# Altium project FlashCraft.PrjPcb
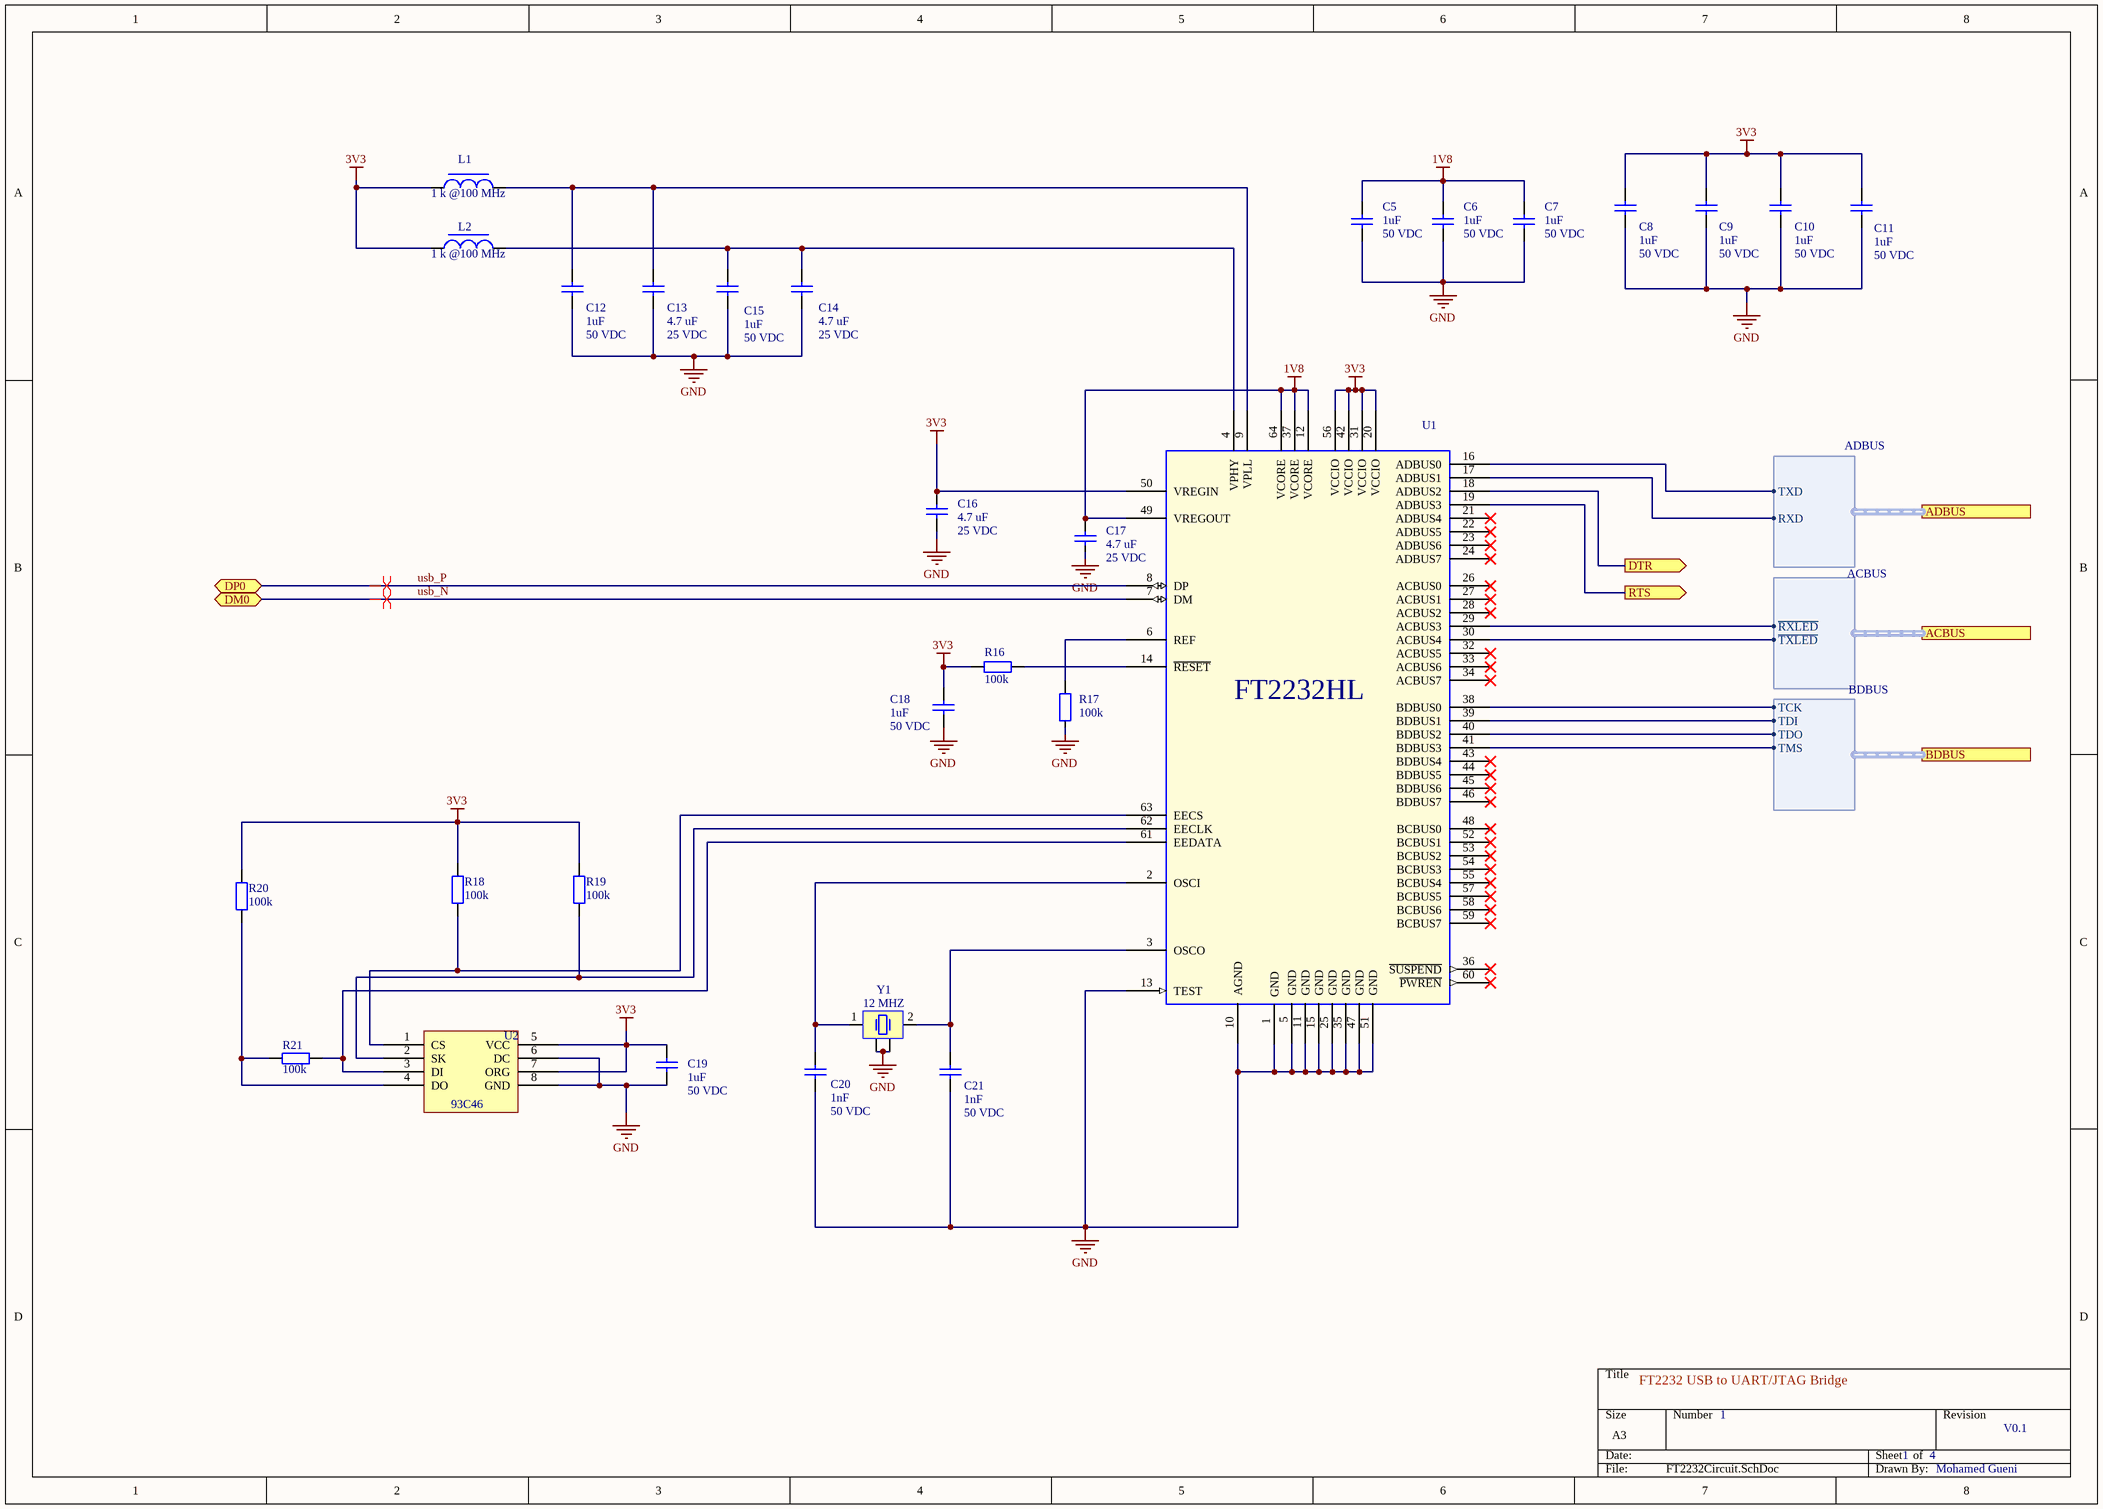
[diagram p0: FT2232Circuit.SchDoc]
4 sheets, 69 parts. Net scope: flat (ports and power ports of the same name join across sheets).
Board file: FlashCraft.PcbDoc
Sheets:
  FT2232Circuit.SchDoc
  USBandPOWER.SchDoc
  AutoProgramCircuit.SchDoc
  ConnectorsCircuit.SchDoc

## Sheet FT2232Circuit.SchDoc
size A3

### Parts
C5  Value 1: 1uF  Value 2: 50 VDC  [CAP-0603]  (hidden comment: Capacitor)
C6  Value 1: 1uF  Value 2: 50 VDC  [CAP-0603]  (hidden comment: Capacitor)
C7  Value 1: 1uF  Value 2: 50 VDC  [CAP-0603]  (hidden comment: Capacitor)
C8  Value 1: 1uF  Value 2: 50 VDC  [CAP-0603]  (hidden comment: Capacitor)
C9  Value 1: 1uF  Value 2: 50 VDC  [CAP-0603]  (hidden comment: Capacitor)
C10  Value 1: 1uF  Value 2: 50 VDC  [CAP-0603]  (hidden comment: Capacitor)
C11  Value 1: 1uF  Value 2: 50 VDC  [CAP-0603]  (hidden comment: Capacitor)
C12  Value 1: 1uF  Value 2: 50 VDC  [CAP-0603]  (hidden comment: Capacitor)
C13  Value 1: 4.7 uF  Value 2: 25 VDC  [CAP-0603]  (hidden comment: Capacitor)
C14  Value 1: 4.7 uF  Value 2: 25 VDC  [CAP-0603]  (hidden comment: Capacitor)
C15  Value 1: 1uF  Value 2: 50 VDC  [CAP-0603]  (hidden comment: Capacitor)
C16  Value 1: 4.7 uF  Value 2: 25 VDC  [CAP-0603]  (hidden comment: Capacitor)
C17  Value 1: 4.7 uF  Value 2: 25 VDC  [CAP-0603]  (hidden comment: Capacitor)
C18  Value 1: 1uF  Value 2: 50 VDC  [CAP-0603]  (hidden comment: Capacitor)
C19  Value 1: 1uF  Value 2: 50 VDC  [CAP-0603]  (hidden comment: Capacitor)
C20  Value 1: 1nF  Value 2: 50 VDC  [CAP-0603]  (hidden comment: Capacitor)
C21  Value 1: 1nF  Value 2: 50 VDC  [CAP-0603]  (hidden comment: Capacitor)
L1  Value 1: 1 k @100 MHz  [RESC3216X18N]  (hidden comment: MPZ1608S102A)
L2  Value 1: 1 k @100 MHz  [RESC3216X18N]  (hidden comment: MPZ1608S102A)
R16  Value 1: 100k  [R0603]  (hidden comment: Resistor)
R17  Value 1: 100k  [R0603]  (hidden comment: Resistor)
R18  Value 1: 100k  [R0603]  (hidden comment: Resistor)
R19  Value 1: 100k  [R0603]  (hidden comment: Resistor)
R20  Value 1: 100k  [R0603]  (hidden comment: Resistor)
R21  Value 1: 100k  [R0603]  (hidden comment: Resistor)
U1  FT2232HL-REEL  [TSQFP50P1200X1200X160-64N]  (value not drawn)
U2  93C46  [SOIC127P600X175-8N]  (value not drawn)
Y1  Value 1: 12 MHZ  [WE-4XTAL3.2x2.5mm]  (hidden comment: XTAL4)

### Ports
ACBUS (harness ACBUS), ADBUS (harness ADBUS), BDBUS (harness BDBUS), DM0 (bidir), DP0 (bidir), DTR (out), RTS (out)

### Harnesses
ADBUS: TXD, RXD
ACBUS: ~{RXLED}, ~{TXLED}
BDBUS: TCK, TDI, TDO, TMS

### Nets
1V8: C5.2 C6.2 C7.2 C17.2 U1.12(VCORE) U1.37(VCORE) U1.49(VREGOUT) U1.64(VCORE)
3V3: C8.2 C9.2 C10.2 C11.2 C16.2 C18.2 C19.2 L1.2 L2.2 R16.1 R18.2 R19.2 R20.2 U1.20(VCCIO) U1.31(VCCIO) U1.42(VCCIO) U1.50(VREGIN) U1.56(VCCIO) U2.5(VCC) U2.7(ORG)
GND: C5.1 C6.1 C7.1 C8.1 C9.1 C10.1 C11.1 C12.1 C13.1 C14.1 C15.1 C16.1 C17.1 C18.1 C19.1 C20.1 C21.1 R17.1 U1.1(GND) U1.5(GND) U1.10(AGND) U1.11(GND) U1.13(TEST) U1.15(GND) U1.25(GND) U1.35(GND) U1.47(GND) U1.51(GND) U2.6(DC) U2.8(GND) Y1.GND1 Y1.GND2
ESP-RXD: U1.17(ADBUS1) ; port ADBUS.RXD
ESP-TCK: U1.38(BDBUS0) ; port BDBUS.TCK
ESP-TDI: U1.39(BDBUS1) ; port BDBUS.TDI
ESP-TDO: U1.40(BDBUS2) ; port BDBUS.TDO
ESP-TMS: U1.41(BDBUS3) ; port BDBUS.TMS
ESP-TXD: U1.16(ADBUS0) ; port ADBUS.TXD
usb_N: U1.7(DM) ; port DM0
usb_P: U1.8(DP) ; port DP0
NetC12_2: C12.2 C13.2 L1.1 U1.9(VPLL)
NetC14_2: C14.2 C15.2 L2.1 U1.4(VPHY)
NetC20_2: C20.2 U1.2(OSCI) Y1.1(OSC1)
NetC21_2: C21.2 U1.3(OSCO) Y1.2(OSC2)
NetD1_3: U1.29(ACBUS3) ; port ACBUS.~{RXLED}
NetD1_4: U1.30(ACBUS4) ; port ACBUS.~{TXLED}
NetQ1_2: U1.19(ADBUS3) ; port RTS
NetQ2_2: U1.18(ADBUS2) ; port DTR
NetR16_2: R16.2 U1.14(~{RESET})
NetR17_2: R17.2 U1.6(REF)
NetR18_1: R18.1 U1.63(EECS) U2.1(CS)
NetR19_1: R19.1 U1.62(EECLK) U2.2(SK)
NetR20_1: R20.1 R21.2 U2.4(DO)
NetR21_1: R21.1 U1.61(EEDATA) U2.3(DI)

Not connected (* = marked no-connect by the designer): U1 21(ADBUS4)* 22(ADBUS5)* 23(ADBUS6)* 24(ADBUS7)* 26(ACBUS0)* 27(ACBUS1)* 28(ACBUS2)* 32(ACBUS5)* 33(ACBUS6)* 34(ACBUS7)* 36(~{SUSPEND})* 43(BDBUS4)* 44(BDBUS5)* 45(BDBUS6)* 46(BDBUS7)* 48(BCBUS0)* 52(BCBUS1)* 53(BCBUS2)* 54(BCBUS3)* 55(BCBUS4)* 57(BCBUS5)* 58(BCBUS6)* 59(BCBUS7)* 60(~{PWREN})*

### Layout directives
differential pair: usb_N, usb_P

### Notes on the sheet
- FT2232 USB to UART/JTAG Bridge
- 1
- 4
- V0.1
- Mohamed Gueni
- (in symbol U-000000002) FT2232HL

### Library data of the parts
C5-C12 C15 C18 C19 = C-000000011: DES: Multilayer Ceramic Capacitors MLCC - SMD/SMT Automotive Grade,MLCC,0603,X7R,50V,1uF,+/-10%,0.8mm; MAN: TDK; MANREF: CGA3E3X7R1H105K080AB; SUP: Mouser; SUPREF: 810-CGA3E3X7R1H105K0; TOL: 10%; FTP: 0603; NOTE: _; Part Number: C-000000011
C13 C14 = C-000000007: MAN: Multilayer Ceramic Capacitors MLCC - SMD/SMT 0603 25Vdc 4.7uF X6S 10%; MANREF: Murata Electronics; DES: GRT188C81E475KE13D; TOL: 10%; FTP: 0603; SUP: Mouser; SUPREF: 81-GRT188C81E475KE3D; NOTE: _; Part Number: C-000000007
C16 C17 = C-000000007: DES: GRT188C81E475KE13D; MAN: Multilayer Ceramic Capacitors MLCC - SMD/SMT 0603 25Vdc 4.7uF X6S 10%; MANREF: Murata Electronics; SUP: Mouser; SUPREF: 81-GRT188C81E475KE3D; TOL: 10%; FTP: 0603; NOTE: _; Part Number: C-000000007
C20 C21 = C-000000010: DES: C0603C102K5RECTU; MAN: Multilayer Ceramic Capacitors MLCC - SMD/SMT 50V 1000pF 0603 X7R 0.1; MANREF: KEMET; SUP: Mouser; SUPREF: 80-C0603C102K5REC; TOL: 10%; FTP: 0603; NOTE: _; Part Number: C-000000010
L1 L2 = L-000000001: DES: Ferrite Beads 1000ohms 0.3ohms 0.8A; MAN: TDK; SUP: Mouser; SUPREF: 810-MPZ1608S102A; Value 2: 800 mA; N°: L-000000001; MANREF: MPZ1608S102A; Footprint: 0603 (1608 metric); DataSheet: https://eu.mouser.com/datasheet/2/400/eads_commercial_power_mpz1608_en-923650.pdf
R16-R21 = R-000000002: TOL: 1 %; DES: Thick Film Resistors - SMD 1/10watt 100Kohms 1%; MAN: Vishay; MANREF: CRCW0603100KFKEA; SUP: Mouser; SUPREF: 71-CRCW0603-100K-E3; Value 2: 100 mW; Part Number: R-000000002; FTP: R0603; NOTE: -
U1 = U-000000002: MAN: USB Interface IC USB HS to Dual UART/ FIFO/SPI/JTAG/I2C; MANREF: FTDI; Value 1: Mouser; Value 2: LQFP-64; TOL: 895-FT2232HL; DES: FT2232HL-REEL; Part Number: U-000000002; NOTE: https://eu.mouser.com/datasheet/2/163/DS_FT2232H-17353.pdf
U2 = U-000000003: DES: 93C46B-I/SN; MAN: EEPROM 64x16; MANREF: Microchip Technology; Value 1: Mouser; Value 2: SOIC-8; TOL: 579-93C46B-I/SN; Part Number: U-000000003; NOTE: https://eu.mouser.com/datasheet/2/268/20001749K-277859.pdf
Y1 = Y-000000002: TOL: 10 PPM; DES: Crystals WE-XTAL 12.0MHz 10ppm 3.2 x 2.5mm; MAN: Wurth Elektronik; MANREF: 830105420809; SUP: Mouser; SUPREF: 710-830105420809; Value 2: 10 Pf; N°: Y-000000002; Footprint: 3.2 mm x 2.5 mm; DataSheet: https://www.we-online.com/components/products/datasheet/830105420809.pdf

## Sheet USBandPOWER.SchDoc
size A4
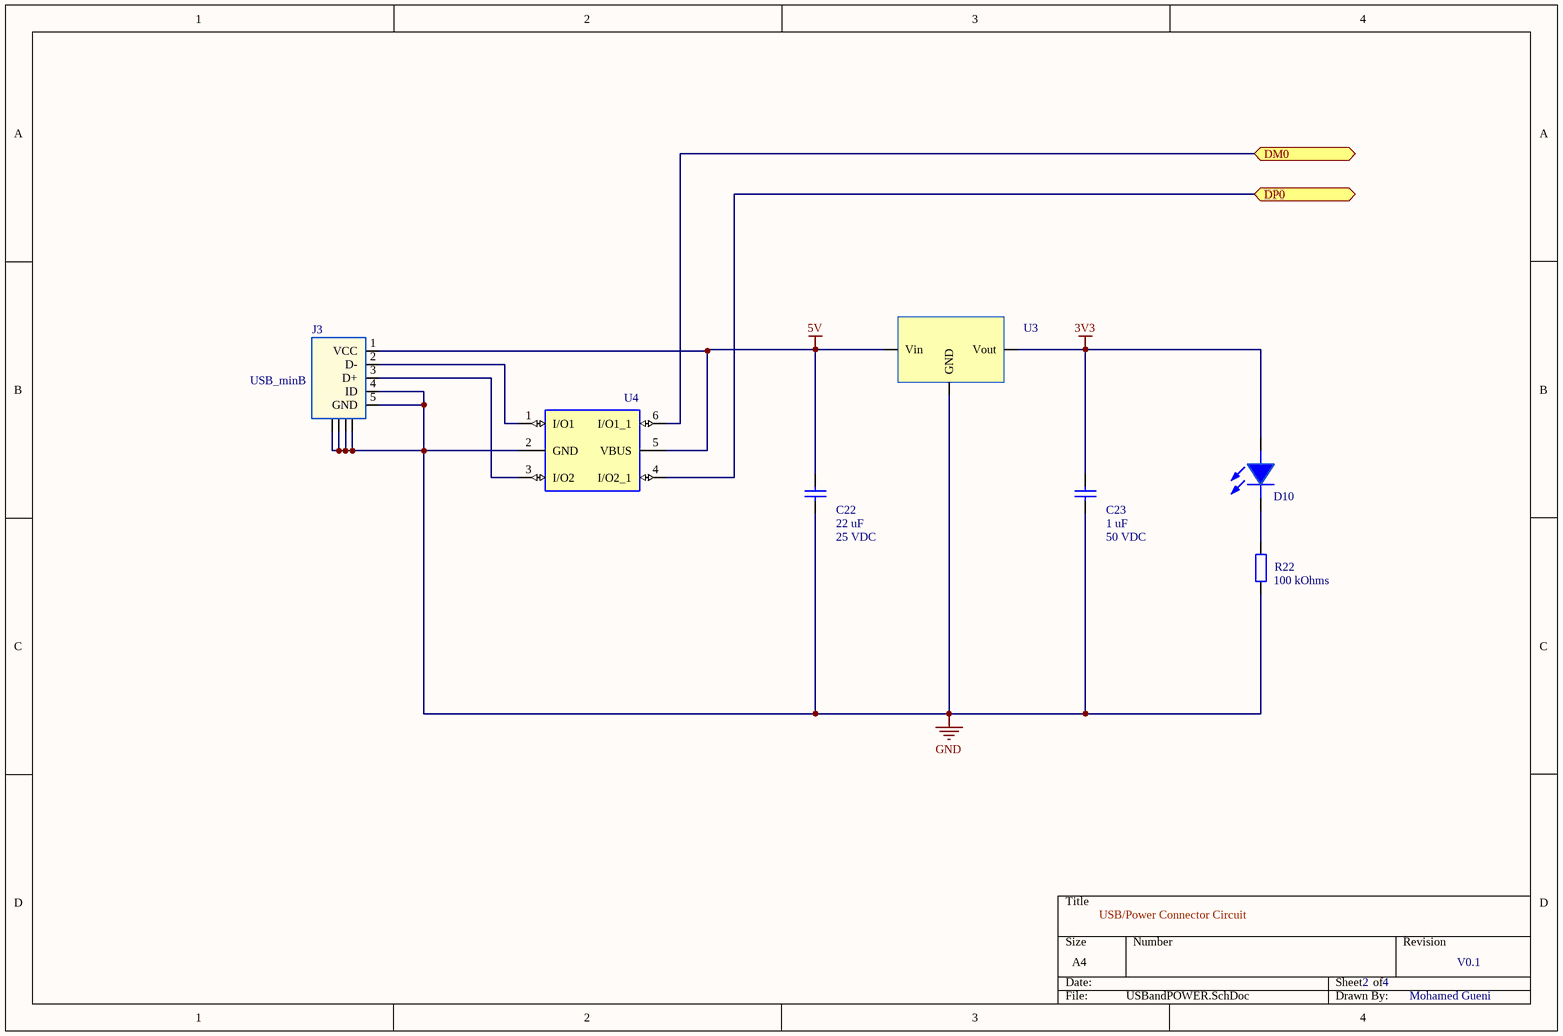
[diagram p1: USBandPOWER.SchDoc]

### Parts
C22  Value 1: 22 uF  Value 2: 25 VDC  [CAP-1210]  (hidden comment: Capacitor)
C23  Value 1: 1 uF  Value 2: 50 VDC  [CAP-1210]  (hidden comment: Capacitor)
D10  SML-H12U8TT86C  [LEDC2012X90N]  (value not drawn)
J3  USB_minB  [XM7D-0512]
R22  Value 1: 100 kOhms  [R0603]  (hidden comment: Resistor)
U3  Voltage Regulator  [REG-SOT230P700X180-4N]  (value not drawn)
U4  USBLC6-2SC6  [SOT95P280X145]  (value not drawn)

### Ports
DM0 (bidir), DP0 (bidir)

### Nets
3V3: C23.2 D10.2(A) U3.3(Vout)
5V: C22.2 J3.1(VCC) U3.2(Vin) U4.5(VBUS)
GND: C22.1 C23.1 J3.4(ID) J3.5(GND) J3.SH1(SHIELD) R22.1 U3.1(GND) U4.2(GND)
usb_N: U4.6(I/O1_1) ; port DM0
usb_P: U4.4(I/O2_1) ; port DP0
NetD10_1: D10.1(K) R22.2
NetJ3_2: J3.2(D-) U4.1(I/O1)
NetJ3_3: J3.3(D+) U4.3(I/O2)

### Notes on the sheet
- USB/Power Connector Circuit
- 2
- 4
- V0.1
- Mohamed Gueni

### Library data of the parts
C22 = C-000000004: DES: Multilayer Ceramic Capacitors MLCC - SMD/SMT 22 uF 25 VDC 10% 1210 X7R; MAN: Murata Electronics; MANREF: GRM32ER71E226KE15L; SUP: Mouser; SUPREF: 81-GRM32ER71E226KE5L; TOL: 10 %; FTP: 1210; NOTE: _; Part Number: C-000000004
C23 = C-000000005: DES: Multilayer Ceramic Capacitors MLCC - SMD/SMT 50V 1uF X7R 1210 10%; MAN: TAIYO YUDEN; MANREF: UMK325B7105KH-T; SUP: Mouser; SUPREF: 963-UMK325B7105KH-T; TOL: 10 %; FTP: 1210; NOTE: _; Part Number: C-000000005
D10 = LED-000000002: DES: Standard LEDs - SMD Red 620nm 40mcd 2.2V; 20mA; 0603; MAN: ROHM Semiconductor; SUP: Mouser; SUPREF: 755-SML-H12U8TT86C; Value 1: 20 mA; Value 2: 2.2 V; N°: LED-000000002; MANREF: SML-H12U8TT86C; Footprint: 0805 (2012 metric); DataSheet: https://eu.mouser.com/datasheet/2/348/sml-h1(c)-e-1508182.pdf
J3 = J-000000003: MAN: USB Connectors USB RightAngle DIP MiniB AuContact 5Pin; MANREF: Omron; FTP: THT; SUP: Mouser; SUPREF: 653-XM7D-0512; NOTE: End of Life: Scheduled for obsolescence and will be discontinued by the manufacturer.; Part Number: J-000000003; DES: XM7D-0512
R22 = R-000000002: as R16 on sheet FT2232Circuit; Part Number: R-000000002; FTP: R0603; NOTE: -
U3 = U-000000004: DES: XC6203E332FR-G; MAN: LDO Voltage Regulators; MANREF: Torex Semiconductor; SUP: 3.3 V; Value 2: SOT-223-3; Value 1: Mouser; TOL: 865-XC6203E332FR-G; FTP: 8 V; Part Number: U-000000004; NOTE: https://eu.mouser.com/datasheet/2/760/XC6203-846590.pdf
U4 = U-000000006: MAN: ESD Suppressors / TVS Diodes ESD Protection Low Cap; MANREF: STMicroelectronics; Value 1: Mouser; Value 2: SOT-666; TOL: 511-USBLC6-2SC6; DES: USBLC6-2SC6; Part Number: U-000000006; NOTE: https://eu.mouser.com/datasheet/2/389/usblc6-2-957370.pdf

## Sheet AutoProgramCircuit.SchDoc
size A4
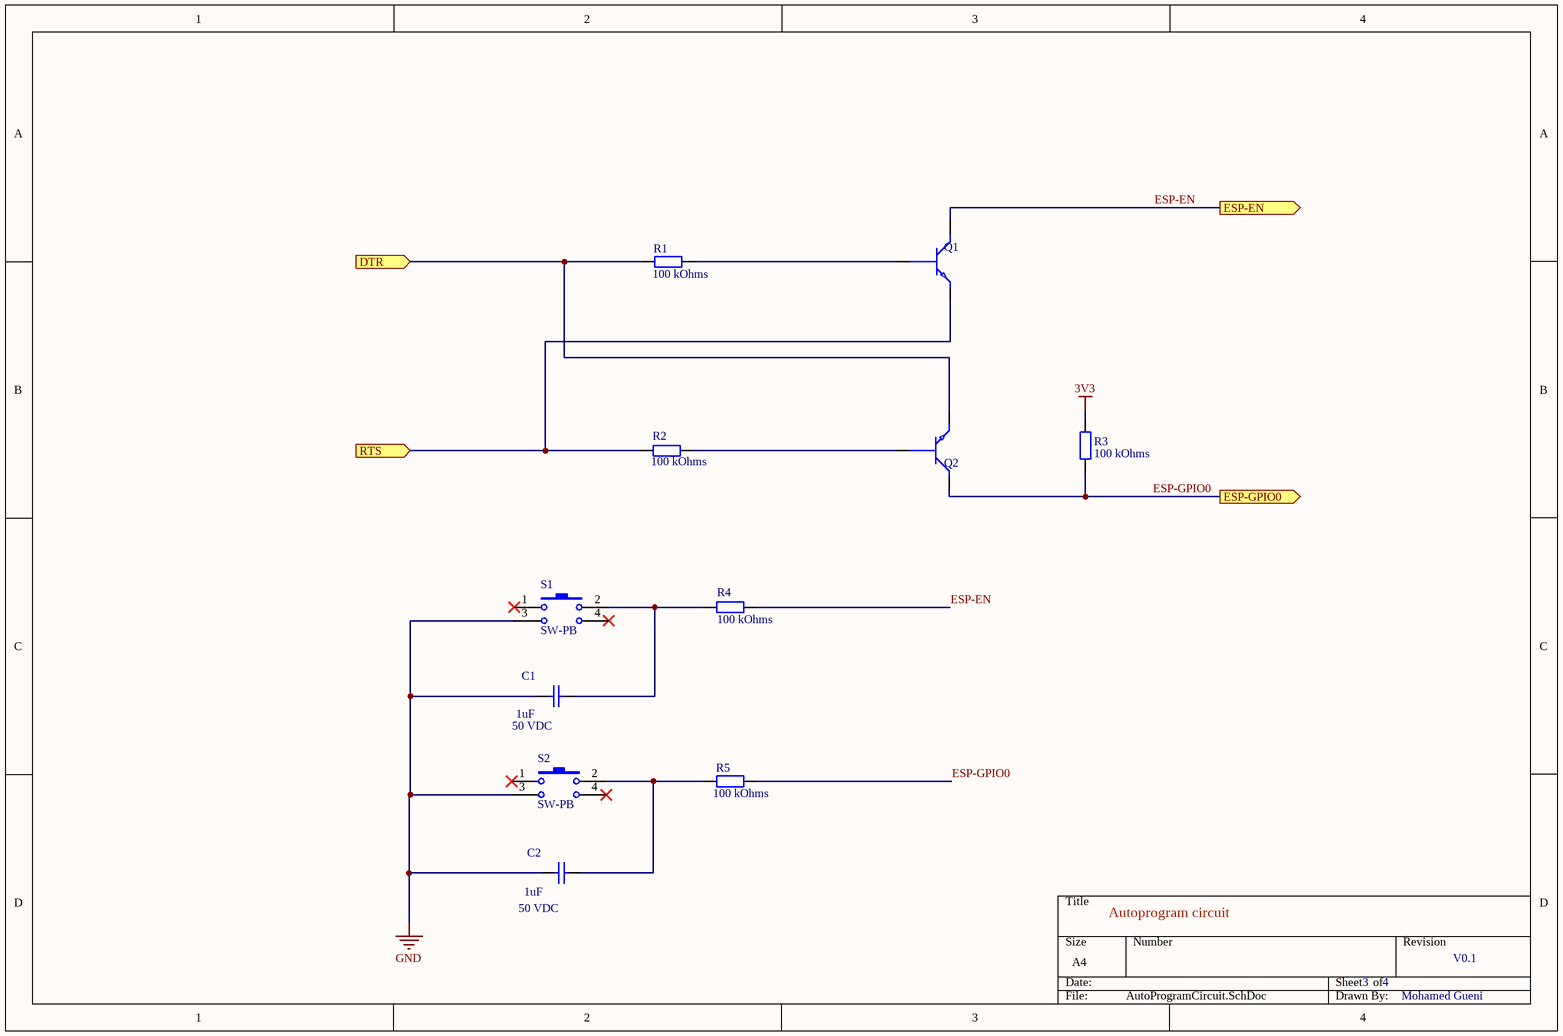
[diagram p2: AutoProgramCircuit.SchDoc]

### Parts
C1  Value 1: 1uF  Value 2: 50 VDC  [CAP-0603]  (hidden comment: Capacitor)
C2  Value 1: 1uF  Value 2: 50 VDC  [CAP-0603]  (hidden comment: Capacitor)
Q1  BJT  [SOT95P245X112-3N]  (value not drawn)
Q2  BJT  [SOT95P245X112-3N]  (value not drawn)
R1  Value 1: 100 kOhms  [R0603]  (hidden comment: Resistor)
R2  Value 1: 100 kOhms  [R0603]  (hidden comment: Resistor)
R3  Value 1: 100 kOhms  [R0603]  (hidden comment: Resistor)
R4  Value 1: 100 kOhms  [R0603]  (hidden comment: Resistor)
R5  Value 1: 100 kOhms  [R0603]  (hidden comment: Resistor)
S1  SW-PB  [SKHHDHA010]
S2  SW-PB  [SKHHDHA010]

### Ports
DTR (in), ESP-EN (out), ESP-GPIO0 (out), RTS (in)

### Nets
3V3: R3.2
GND: C1.1 C2.1 S1.3 S2.3
ESP-EN: Q1.3(C) R4.2 ; port ESP-EN
ESP-GPIO0: Q2.3(C) R3.1 R5.2 ; port ESP-GPIO0
NetC1_2: C1.2 R4.1 S1.2
NetC2_2: C2.2 R5.1 S2.2
NetQ1_1: Q1.1(B) R1.2
NetQ1_2: Q1.2(E) R2.1 ; port RTS
NetQ2_1: Q2.1(B) R2.2
NetQ2_2: Q2.2(E) R1.1 ; port DTR

Not connected (* = marked no-connect by the designer): S1 1* 4*; S2 1* 4*

### Notes on the sheet
- Autoprogram circuit
- 3
- 4
- V0.1
- Mohamed Gueni

### Library data of the parts
C1 C2 = C-000000011: as C5 on sheet FT2232Circuit; Part Number: C-000000011
Q1 Q2 = Q-000000003: DES: MMSS8050-H-TP; MAN: Bipolar Transistors - BJT 625mW, 25V, 1500mA; MANREF: Micro Commercial Components (MCC); SUP: 1.5 A; SUPREF: Bipolar; Value 1: Mouser; Value 2: 833-MMSS8050-H-TP; TOL: SOT-23-3; FTP: 5 V; NOTE: NPN; DataSheet: https://eu.mouser.com/datasheet/2/258/MMSS8050(SOT-23)-276387.pdf; Part Number: Q-000000003
R1-R5 = R-000000002: as R16 on sheet FT2232Circuit; Part Number: R-000000002; FTP: R0603; NOTE: -
S1 S2 = SW-000000001: DES: Tactile Switches 50 mAmps at 12 Volts; MAN: ALPS / Gravitech / Gravitech; SUP: Mouser; SUPREF: 688-SKHHDHA010; N°: SW-000000001; MANREF: SKHHDHA010; Footprint: Through Hole; DataSheet: https://eu.mouser.com/datasheet/2/15/SKHH-1370651.pdf

## Sheet ConnectorsCircuit.SchDoc
size A4
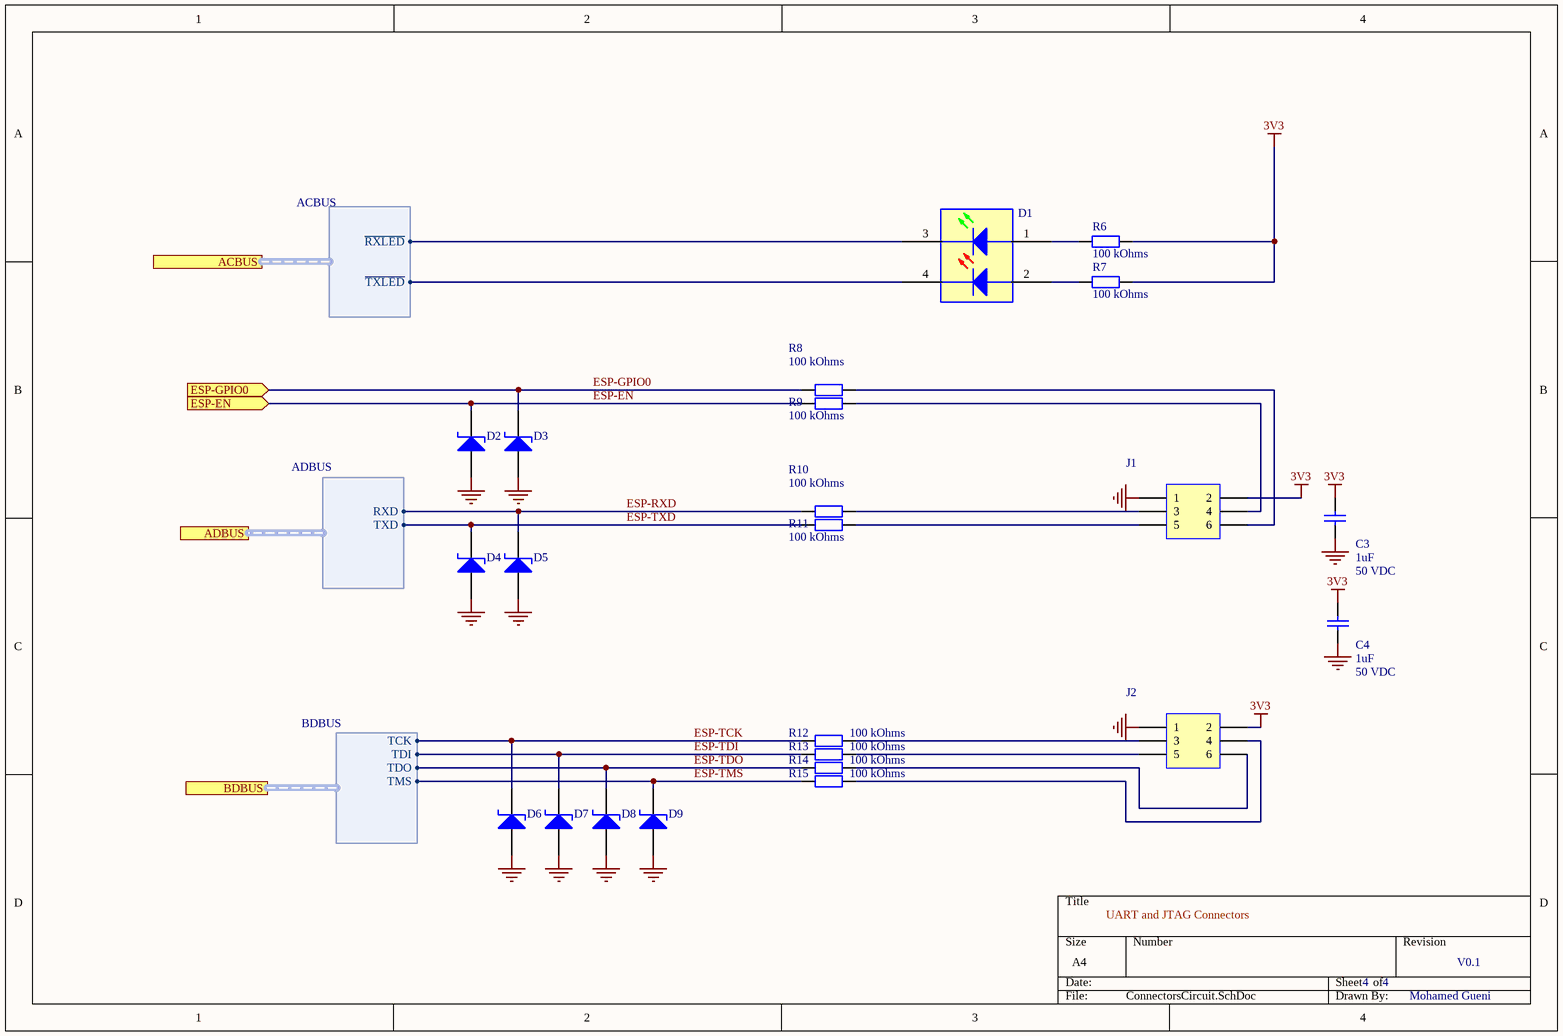
[diagram p3: ConnectorsCircuit.SchDoc]

### Parts
C3  Value 1: 1uF  Value 2: 50 VDC  [CAP-0603]  (hidden comment: Capacitor)
C4  Value 1: 1uF  Value 2: 50 VDC  [CAP-0603]  (hidden comment: Capacitor)
D1  LTST-C155KGJRKT  [LTSTC155KGJRKT]  (value not drawn)
D2  ESD7351HT1G  [SOD-323-2]  (value not drawn)
D3  ESD7351HT1G  [SOD-323-2]  (value not drawn)
D4  ESD7351HT1G  [SOD-323-2]  (value not drawn)
D5  ESD7351HT1G  [SOD-323-2]  (value not drawn)
D6  ESD7351HT1G  [SOD-323-2]  (value not drawn)
D7  ESD7351HT1G  [SOD-323-2]  (value not drawn)
D8  ESD7351HT1G  [SOD-323-2]  (value not drawn)
D9  ESD7351HT1G  [SOD-323-2]  (value not drawn)
J1  Header 3X2  [SHDR6W75P200_2X3_865X640X650P]  (value not drawn)
J2  Header 3X2  [SHDR6W75P200_2X3_865X640X650P]  (value not drawn)
R6  Value 1: 100 kOhms  [R0603]  (hidden comment: Resistor)
R7  Value 1: 100 kOhms  [R0603]  (hidden comment: Resistor)
R8  Value 1: 100 kOhms  [R0603]  (hidden comment: Resistor)
R9  Value 1: 100 kOhms  [R0603]  (hidden comment: Resistor)
R10  Value 1: 100 kOhms  [R0603]  (hidden comment: Resistor)
R11  Value 1: 100 kOhms  [R0603]  (hidden comment: Resistor)
R12  Value 1: 100 kOhms  [R0603]  (hidden comment: Resistor)
R13  Value 1: 100 kOhms  [R0603]  (hidden comment: Resistor)
R14  Value 1: 100 kOhms  [R0603]  (hidden comment: Resistor)
R15  Value 1: 100 kOhms  [R0603]  (hidden comment: Resistor)

### Ports
ACBUS (harness ACBUS), ADBUS (harness ADBUS), BDBUS (harness BDBUS), ESP-EN (in), ESP-GPIO0 (in)

### Harnesses
ADBUS: RXD, TXD
ACBUS: ~{RXLED}, ~{TXLED}
BDBUS: TCK, TDI, TDO, TMS

### Nets
3V3: C3.2 C4.2 J1.2 J2.2 R6.2 R7.2
GND: C3.1 C4.1 D2.1 D3.1 D4.1 D5.1 D6.1 D7.1 D8.1 D9.1 J1.1 J2.1
ESP-EN: D2.2(K1A2) R9.1 ; port ESP-EN
ESP-GPIO0: D3.2(K1A2) R8.1 ; port ESP-GPIO0
ESP-RXD: D5.2(K1A2) R10.1 ; port ADBUS.RXD
ESP-TCK: D6.2(K1A2) R12.1 ; port BDBUS.TCK
ESP-TDI: D7.2(K1A2) R13.1 ; port BDBUS.TDI
ESP-TDO: D8.2(K1A2) R14.1 ; port BDBUS.TDO
ESP-TMS: D9.2(K1A2) R15.1 ; port BDBUS.TMS
ESP-TXD: D4.2(K1A2) R11.1 ; port ADBUS.TXD
NetD1_1: D1.1 R6.1
NetD1_2: D1.2 R7.1
NetD1_3: D1.3 ; port ACBUS.~{RXLED}
NetD1_4: D1.4 ; port ACBUS.~{TXLED}
NetJ1_3: J1.3 R10.2
NetJ1_4: J1.4 R9.2
NetJ1_5: J1.5 R11.2
NetJ1_6: J1.6 R8.2
NetJ2_3: J2.3 R12.2
NetJ2_4: J2.4 R15.2
NetJ2_5: J2.5 R13.2
NetJ2_6: J2.6 R14.2

### Notes on the sheet
- UART and JTAG Connectors
- 4
- V0.1
- Mohamed Gueni

### Library data of the parts
C3 C4 = C-000000011: as C5 on sheet FT2232Circuit; Part Number: C-000000011
D1 = LED-000000001: DES: Standard LEDs - SMD Green/Red Clear; MAN: Lite-On; SUP: Mouser; SUPREF: 859-LTST-C155KGJRKT; Value 1: 20 mA; Value 2: 2 V; N°: LED-000000001; MANREF: LTST-C155KGJRKT; Footprint: 1311 (3227 metric); DataSheet: https://eu.mouser.com/datasheet/2/239/LTST-C155KGJRKT-1141409.pdf
D2-D9 = D-000000004: MAN: onsemi; DES: ESD Protection Diodes / TVS Diodes UNIDIRECTIONAL 3.3V ESD PR; Value 1: 5 V; Value 2: 3 A; TOL: _; SUP: Mouser; SUPREF: 863-ESD7351HT1G; Part Number: D-000000004; MANREF: ESD7351HT1G; FTP: SOD-323-2; NOTE: _; TOL1: _
J1 J2 = J-000000001: DES: 87833-0620; MAN: Headers & Wire Housings MGrid Hdr Shrd Vt W/ t W/Lck .76AuLF 6Ckt; MANREF: Molex / Molex; SUP: Mouser; SUPREF: 538-87833-0620; FTP: THT; NOTE: _; Part Number: J-000000001
R6-R15 = R-000000002: as R16 on sheet FT2232Circuit; Part Number: R-000000002; FTP: R0603; NOTE: -

## Nets that join several sheets
3V3: FT2232Circuit (20 pins), USBandPOWER (C23.2 D10.2 U3.3), AutoProgramCircuit (R3.2), ConnectorsCircuit (6 pins)
GND: FT2232Circuit (32 pins), USBandPOWER (8 pins), AutoProgramCircuit (C1.1 C2.1 S1.3 S2.3), ConnectorsCircuit (12 pins)
ESP-EN: AutoProgramCircuit (Q1.3 R4.2), ConnectorsCircuit (D2.2 R9.1)
ESP-GPIO0: AutoProgramCircuit (Q2.3 R3.1 R5.2), ConnectorsCircuit (D3.2 R8.1)
ESP-RXD: FT2232Circuit (U1.17), ConnectorsCircuit (D5.2 R10.1)
ESP-TCK: FT2232Circuit (U1.38), ConnectorsCircuit (D6.2 R12.1)
ESP-TDI: FT2232Circuit (U1.39), ConnectorsCircuit (D7.2 R13.1)
ESP-TDO: FT2232Circuit (U1.40), ConnectorsCircuit (D8.2 R14.1)
ESP-TMS: FT2232Circuit (U1.41), ConnectorsCircuit (D9.2 R15.1)
ESP-TXD: FT2232Circuit (U1.16), ConnectorsCircuit (D4.2 R11.1)
NetD1_3: FT2232Circuit (U1.29), ConnectorsCircuit (D1.3)
NetD1_4: FT2232Circuit (U1.30), ConnectorsCircuit (D1.4)
NetQ1_2: FT2232Circuit (U1.19), AutoProgramCircuit (Q1.2 R2.1)
NetQ2_2: FT2232Circuit (U1.18), AutoProgramCircuit (Q2.2 R1.1)
usb_N: FT2232Circuit (U1.7), USBandPOWER (U4.6)
usb_P: FT2232Circuit (U1.8), USBandPOWER (U4.4)